# EAGLE schematic PFOP (EAGLE 9.1.3)
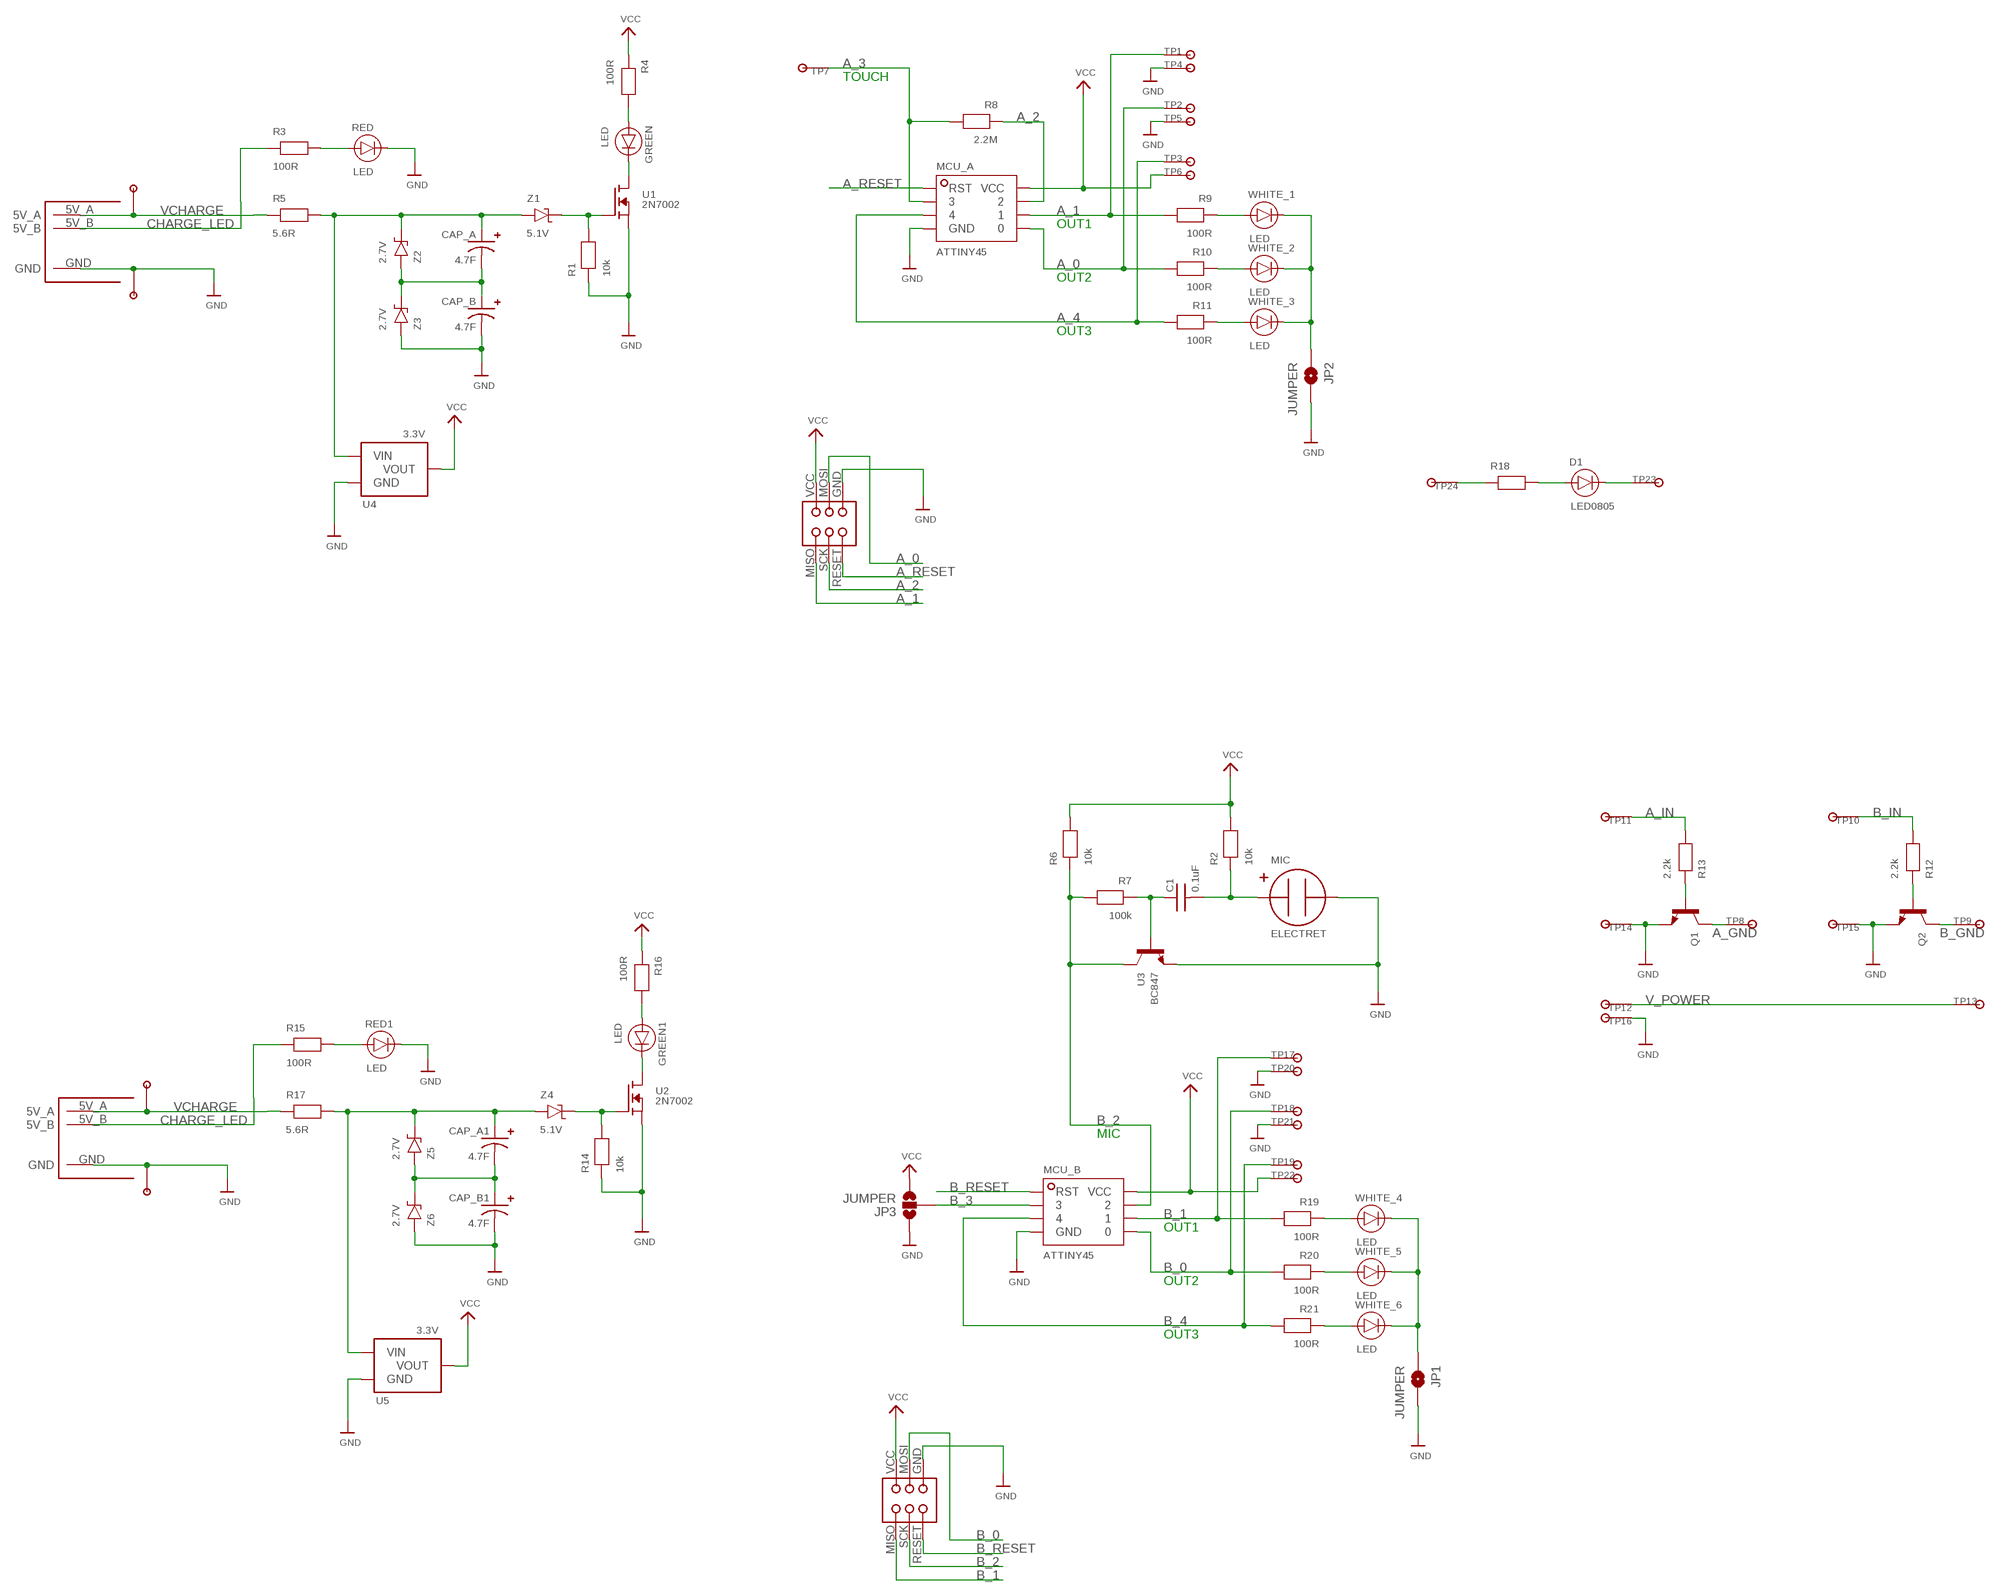
[diagram p0: schematic, sheet 1]

## Parts
C1  0.1uF  CAP  [0805]
CAP_A  4.7F  SUPERCAP  [SUPERCAP_2.7V-4.7F]
CAP_A1  4.7F  SUPERCAP  [SUPERCAP_2.7V-4.7F]
CAP_B  4.7F  SUPERCAP  [SUPERCAP_2.7V-4.7F]
CAP_B1  4.7F  SUPERCAP  [SUPERCAP_2.7V-4.7F]
D1  LED0805  [0805_LED]
GREEN  LED  LED0805  [0805_LED]
GREEN1  LED  LED0805  [0805_LED]
J1  ISP_HEADER  [ISP_HEADER]
J2  ISP_HEADER  [ISP_HEADER]
JP1  JUMPER  JUMPER-SMT_2_NO_NO-SILK  [SMT-JUMPER_2_NO_NO-SILK]
JP2  JUMPER  JUMPER-SMT_2_NO_NO-SILK  [SMT-JUMPER_2_NO_NO-SILK]
JP3  JUMPER  JUMPER-SMT_3_NO_NO-SILK  [SMT-JUMPER_3_NO_NO-SILK]
MCU_A  ATTINY45  [TSSOP-8]
MCU_B  ATTINY45  [TSSOP-8]
MIC  ELECTRET  [ELECTRET_4.5MM]
Q1  POWER_TRANSISTOR  [POWER_TRANSISTOR]
Q2  POWER_TRANSISTOR  [POWER_TRANSISTOR]
R1  10k  RESISTOR  [0805]
R2  10k  RESISTOR  [0805]
R3  100R  RESISTOR  [0805]
R4  100R  RESISTOR  [0805]
R5  5.6R  RESISTORPOWER  [2512]
R6  10k  RESISTOR  [0805]
R7  100k  RESISTOR  [0805]
R8  2.2M  RESISTOR  [0805]
R9  100R  RESISTOR  [0805]
R10  100R  RESISTOR  [0805]
R11  100R  RESISTOR  [0805]
R12  2.2k  RESISTOR  [0805]
R13  2.2k  RESISTOR  [0805]
R14  10k  RESISTOR  [0805]
R15  100R  RESISTOR  [0805]
R16  100R  RESISTOR  [0805]
R17  5.6R  RESISTORPOWER  [2512]
R18  RESISTOR  [0805]
R19  100R  RESISTOR  [0805]
R20  100R  RESISTOR  [0805]
R21  100R  RESISTOR  [0805]
RED  LED  LED0805  [0805_LED]
RED1  LED  LED0805  [0805_LED]
TP1  SEWTAPBIG  [BIGTAP]
TP2  SEWTAPBIG  [BIGTAP]
TP3  SEWTAPBIG  [BIGTAP]
TP4  SEWTAPBIG  [BIGTAP]
TP5  SEWTAPBIG  [BIGTAP]
TP6  SEWTAPBIG  [BIGTAP]
TP7  SEWTAP  [BIGTAP_TOUCH]
TP8  SEWTAPBIG  [BIGTAP]
TP9  SEWTAPBIG  [BIGTAP]
TP10  SEWTAPBIG  [BIGTAP]
TP11  SEWTAPBIG  [BIGTAP]
TP12  SEWTAPBIG  [BIGTAP]
TP13  SEWTAPBIG  [BIGTAP]
TP14  SEWTAPBIG  [BIGTAP]
TP15  SEWTAPBIG  [BIGTAP]
TP16  SEWTAPBIG  [BIGTAP]
TP17  SEWTAPBIG  [BIGTAP]
TP18  SEWTAPBIG  [BIGTAP]
TP19  SEWTAPBIG  [BIGTAP]
TP20  SEWTAPBIG  [BIGTAP]
TP21  SEWTAPBIG  [BIGTAP]
TP22  SEWTAPBIG  [BIGTAP]
TP23  SEWTAPSEQUIN  [SEQUIN_TERMINAL]
TP24  SEWTAPSEQUIN  [SEQUIN_TERMINAL]
U1  2N7002  [SOT23]
U2  2N7002  [SOT23]
U3  BC847  [SOT23]
U4  3.3V  LDO_REGULATOR  [SOT23]
U5  3.3V  LDO_REGULATOR  [SOT23]
U$1  USB_CONN_POWER  [USB_CONN_POWER]
U$2  1PIN  [1PIN]
U$3  1PIN  [1PIN]
U$4  USB_CONN_POWER  [USB_CONN_POWER]
U$5  1PIN  [1PIN]
U$6  1PIN  [1PIN]
WHITE_1  LED  LEDPLCC-2  [PLCC-2_LED]
WHITE_2  LED  LEDPLCC-2  [PLCC-2_LED]
WHITE_3  LED  LEDPLCC-2  [PLCC-2_LED]
WHITE_4  LED  LEDPLCC-2  [PLCC-2_LED]
WHITE_5  LED  LEDPLCC-2  [PLCC-2_LED]
WHITE_6  LED  LEDPLCC-2  [PLCC-2_LED]
Z1  5.1V  ZENER  [MINIMELF]
Z2  2.7V  ZENER  [MINIMELF]
Z3  2.7V  ZENER  [MINIMELF]
Z4  5.1V  ZENER  [MINIMELF]
Z5  2.7V  ZENER  [MINIMELF]
Z6  2.7V  ZENER  [MINIMELF]

## Nets
A_0: J1.MOSI MCU_A.5 R10.2 TP2.P$1(SEW)
A_1: J1.MISO MCU_A.6 R9.2 TP1.P$1(SEW)
A_2: J1.SCK MCU_A.7 R8.1
A_3: MCU_A.2 R8.2 TP7.P$1(SEW)
A_4: MCU_A.3 R11.2 TP3.P$1(SEW)
A_GND: Q1.C TP8.P$1(SEW)
A_IN: R13.2 TP11.P$1(SEW)
A_RESET: J1.RESET MCU_A.1(RST)
B_0: J2.MOSI MCU_B.5 R20.2 TP18.P$1(SEW)
B_1: J2.MISO MCU_B.6 R19.2 TP17.P$1(SEW)
B_2: J2.SCK MCU_B.7 R6.1 R7.2 U3.3(C)
B_3: JP3.2 MCU_B.2
B_4: MCU_B.3 R21.2 TP19.P$1(SEW)
B_GND: Q2.C TP9.P$1(SEW)
B_IN: R12.2 TP10.P$1(SEW)
B_RESET: J2.RESET MCU_B.1(RST)
CHARGE_LED: R3.1 R15.1 U$1.5V_B U$4.5V_B
GND: CAP_B1.- CAP_B.- J1.GND J2.GND JP1.2 JP2.2 JP3.1 MCU_A.4(GND) MCU_B.4(GND) MIC.-(V-) Q1.E Q2.E R1.1 R14.1 RED1.- RED.- TP4.P$1(SEW) TP5.P$1(SEW) TP14.P$1(SEW) TP15.P$1(SEW) TP16.P$1(SEW) TP20.P$1(SEW) TP21.P$1(SEW) U1.2(S) U2.2(S) U3.2(E) U4.1(GND) U5.1(GND) U$1.GND U$3.P$1 U$4.GND U$6.P$1 Z3.1 Z6.1
N$1: R3.2 RED.+
N$2: R15.2 RED1.+
N$3: R1.2 U1.1(G) Z1.2
N$4: GREEN.- U1.3(D)
N$5: CAP_A.- CAP_B.+ Z2.1 Z3.2
N$6: R14.2 U2.1(G) Z4.2
N$7: GREEN.+ R4.2
N$8: C1.2 MIC.+(V+) R2.1
N$9: GREEN1.- U2.3(D)
N$10: C1.1 R7.1 U3.1(B)
N$11: Q2.B R12.1
N$12: CAP_A1.- CAP_B1.+ Z5.1 Z6.2
N$13: GREEN1.+ R16.2
N$14: R9.1 WHITE_1.+
N$15: R10.1 WHITE_2.+
N$16: R11.1 WHITE_3.+
N$17: JP2.1 WHITE_1.- WHITE_2.- WHITE_3.-
N$18: R19.1 WHITE_4.+
N$19: R20.1 WHITE_5.+
N$20: Q1.B R13.1
N$21: R21.1 WHITE_6.+
N$22: JP1.1 WHITE_4.- WHITE_5.- WHITE_6.-
N$23: R18.1 TP24.P$1(SEW)
N$24: D1.+ R18.2
N$25: D1.- TP23.P$1(SEW)
V_POWER: TP12.P$1(SEW) TP13.P$1(SEW)
VCAP: CAP_A.+ R5.2 U4.3(VIN) Z1.1 Z2.2
VCAP1: CAP_A1.+ R17.2 U5.3(VIN) Z4.1 Z5.2
VCC: J1.VCC J2.VCC JP3.3 MCU_A.8(VCC) MCU_B.8(VCC) R2.2 R4.1 R6.2 R16.1 TP6.P$1(SEW) TP22.P$1(SEW) U4.2(VOUT) U5.2(VOUT)
VCHARGE: R5.1 R17.1 U$1.5V_A U$2.P$1 U$4.5V_A U$5.P$1

## Notes on the sheet
- TOUCH
- OUT1
- OUT2
- OUT3
- MIC
- OUT1
- OUT2
- OUT3

## Library data of the parts
C1 = PFOP:CAP
CAP_A CAP_A1 CAP_B CAP_B1 = PFOP:SUPERCAP
D1 GREEN GREEN1 RED RED1 WHITE_1-WHITE_6 = PFOP:LED
J1 J2 = PFOP:ISP_HEADER
JP1 JP2 = PFOP:JUMPER-SMT_2_NO: Normally open jumper This jumper has two pads in close proximity to each other. Apply solder to close the connection. Round pads are easier to solder for beginners, but are a lot larger. SparkFun Product that uses the round pads: SparkFun EL Sequencer <https://www.sparkfun.com/products/12781>
JP3 = PFOP:JUMPER-SMT_3_NO: Normally open jumper This jumper has three pads in close proximity to each other. Apply solder to close the connection(s).
MCU_A MCU_B = PFOP:ATTINY45
MIC = PFOP:ELECTRET
Q1 Q2 = PFOP:POWER_TRANSISTOR
R1-R21 = PFOP:RESISTOR
TP1-TP24 = PFOP:SEWTAP
U1 U2 = PFOP:2N7002
U3 = PFOP:BC847
U4 U5 = PFOP:LDO_REGULATOR
U$1 U$4 = PFOP:USB_CONN_POWER
U$2 U$3 U$5 U$6 = PFOP:1PIN
Z1-Z6 = PFOP:ZENER